# Altium project M7_DSP.PrjPcb (part 2 of 2)
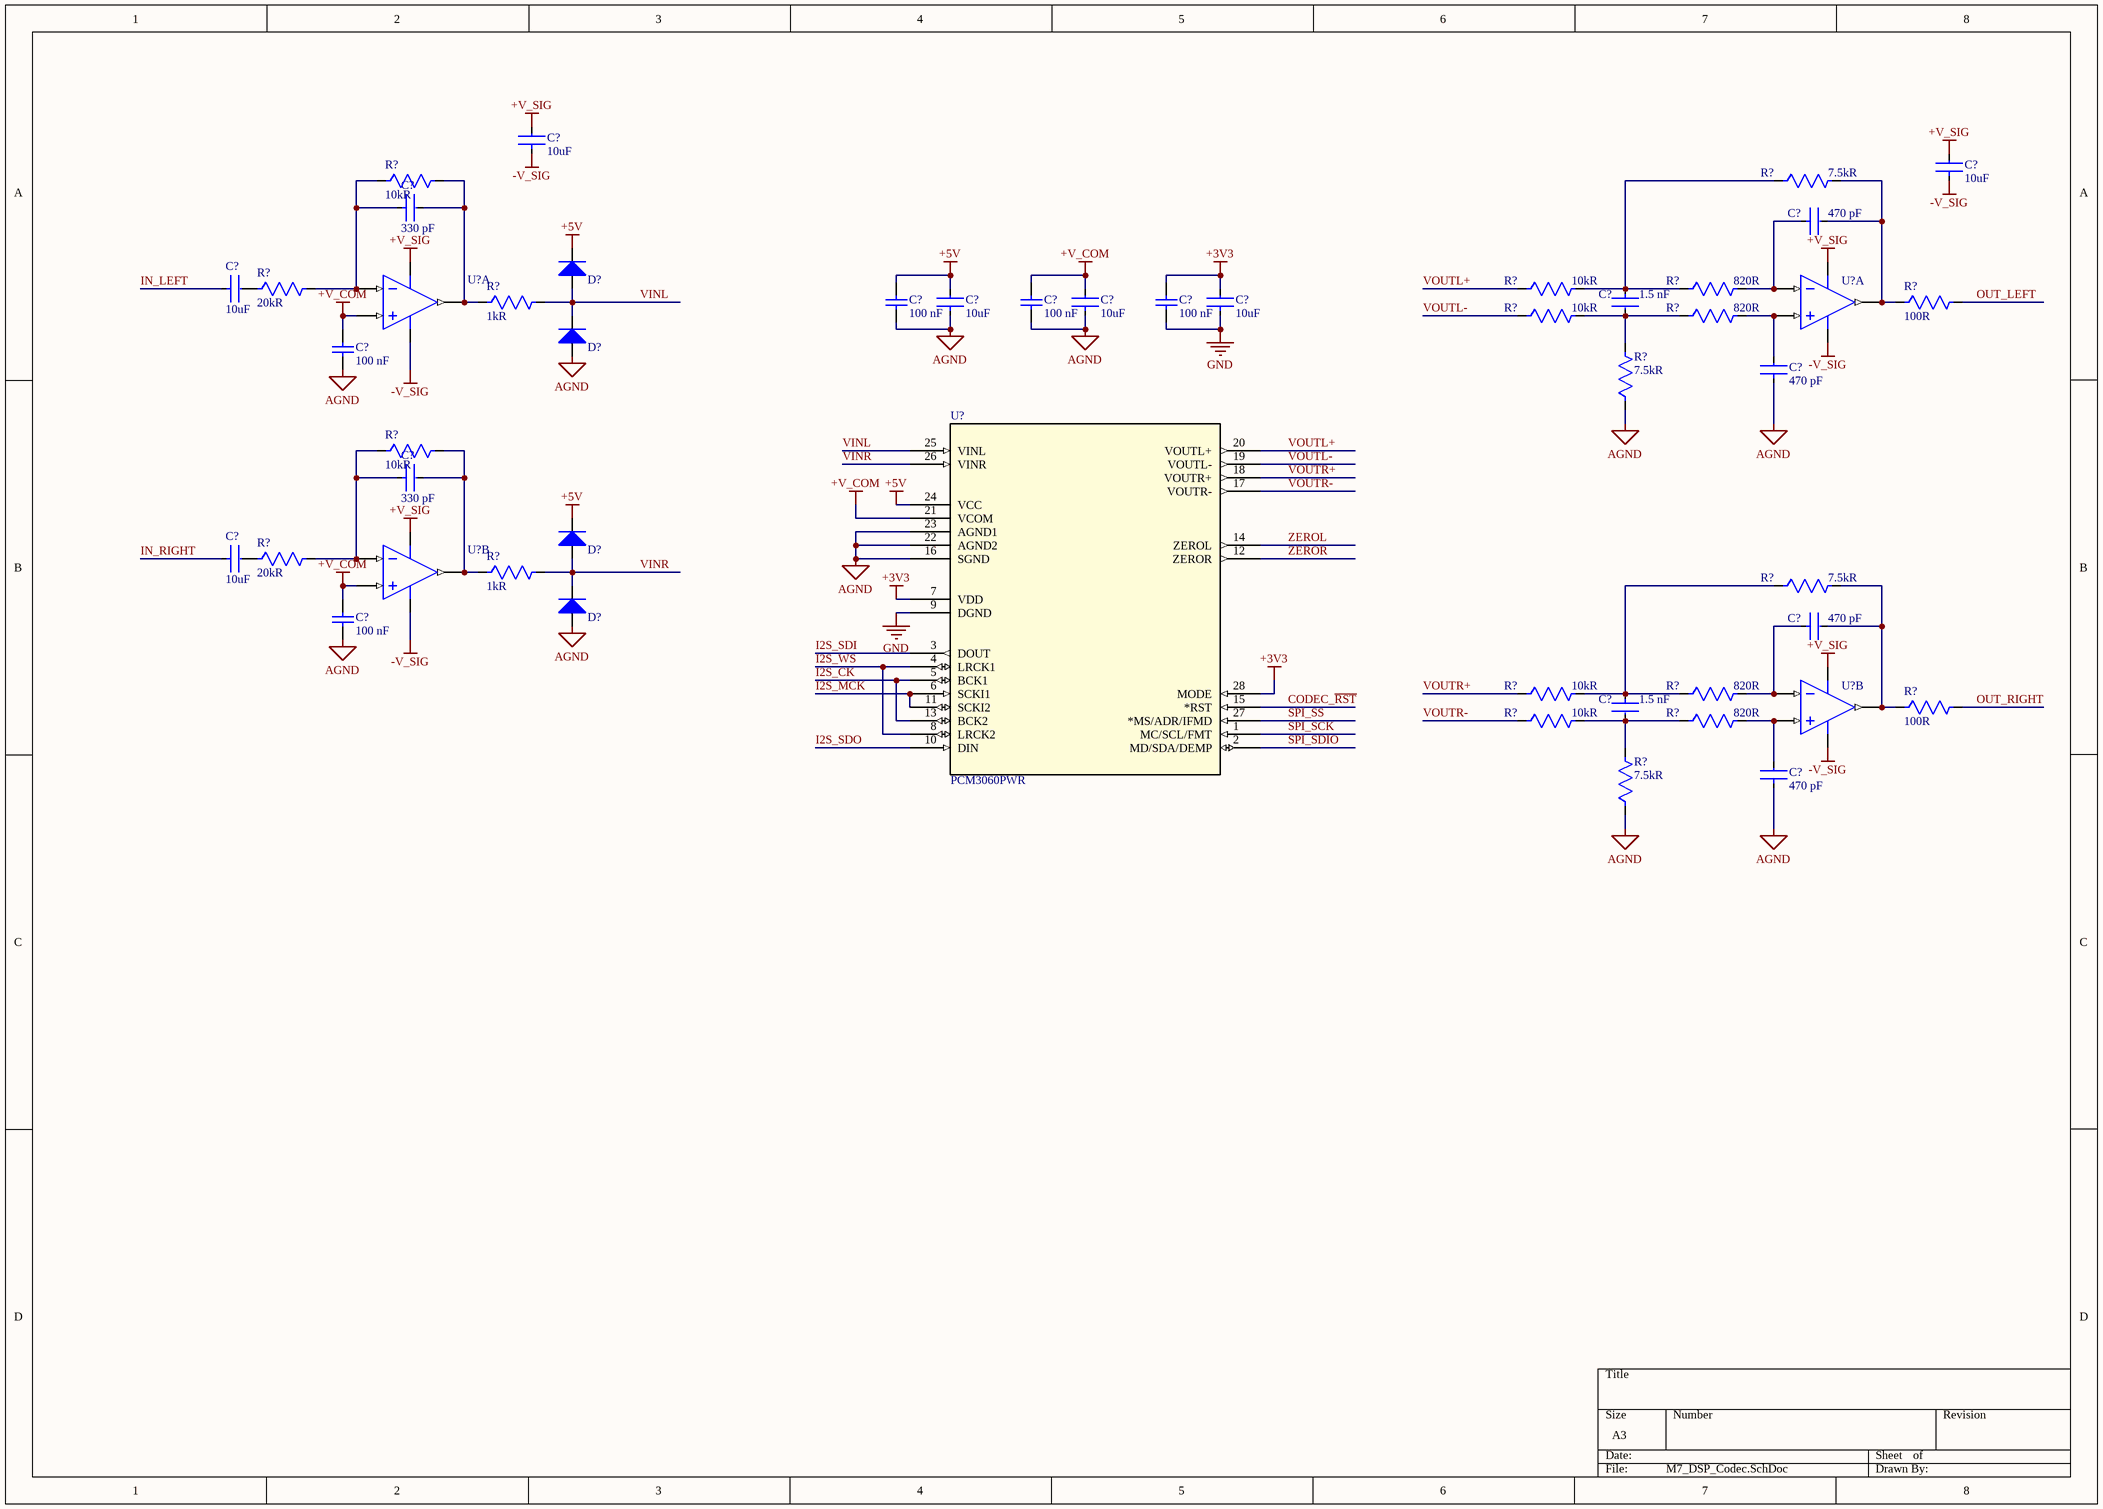
[diagram p4: M7_DSP_Codec.SchDoc]

## Nets that join several sheets
+3V3: M7_DSP_MCU_IO (J?.1 J?.2), M7_DSP_MCU_Power (25 pins), M7_DSP_Power_Supply (7 pins), M7_DSP_Codec (C?#34.1 C?#39.2 U?#10.7 U?#10.28)
+5V: M7_DSP_Power_Supply (C?#26.1 C?#27.1 U?#5.2 U?#5.4), M7_DSP_Codec (5 pins)
AGND: M7_DSP_MCU_IO (12 pins), M7_DSP_MCU_Power (24 pins), M7_DSP_Power_Supply (21 pins), M7_DSP_Codec (18 pins)
I2S_CK: M7_DSP_MCU_IO (U?#2.41), M7_DSP_Codec (U?#10.5 U?#10.13)
I2S_MCK: M7_DSP_MCU_IO (U?#1.44), M7_DSP_Codec (U?#10.6 U?#10.11)
I2S_SDI: M7_DSP_MCU_IO (U?#2.42), M7_DSP_Codec (U?#10.3)
I2S_SDO: M7_DSP_MCU_IO (U?#2.43), M7_DSP_Codec (U?#10.10)
I2S_WS: M7_DSP_MCU_IO (U?#2.40), M7_DSP_Codec (U?#10.4 U?#10.8)
ZEROL: M7_DSP_MCU_IO (U?#2.34), M7_DSP_Codec (U?#10.14)
ZEROR: M7_DSP_MCU_IO (U?#2.35), M7_DSP_Codec (U?#10.12)